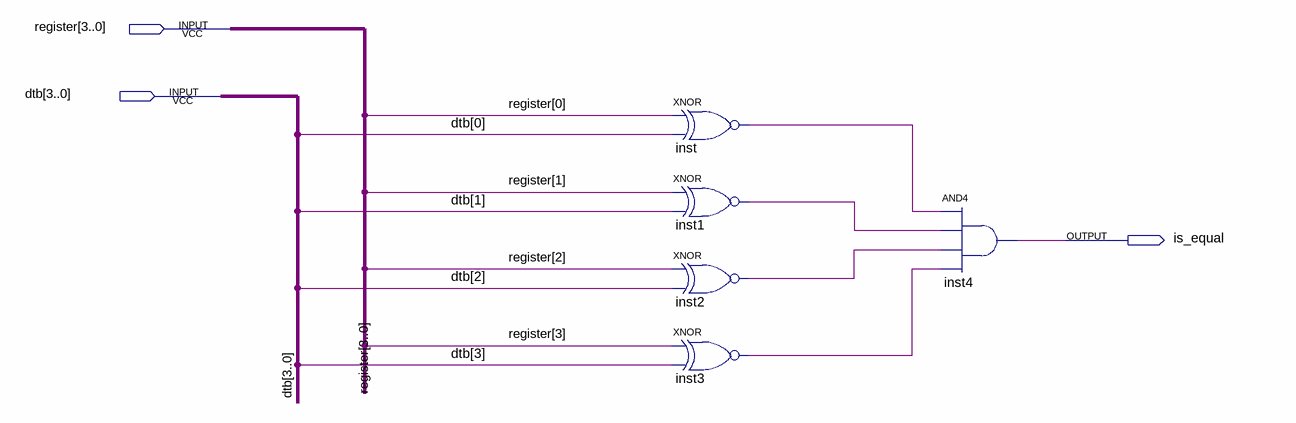
[diagram p0: schematic sheet]
// Quartus schematic is_equal4.bdf as structural Verilog: 5 symbols, 3 pins
module is_equal4 (
  input  [3:0] register,
  input  [3:0] dtb,
  output is_equal
);

  wire inst1_out, inst2_out, inst3_out, inst_out;

  xnor inst (inst_out, register[0], dtb[0]);
  xnor inst1 (inst1_out, register[1], dtb[1]);
  xnor inst2 (inst2_out, register[2], dtb[2]);
  xnor inst3 (inst3_out, register[3], dtb[3]);
  and inst4 (is_equal, inst_out, inst1_out, inst2_out, inst3_out);
endmodule
